# EAGLE design xclock_A (EAGLE 7.7.0)
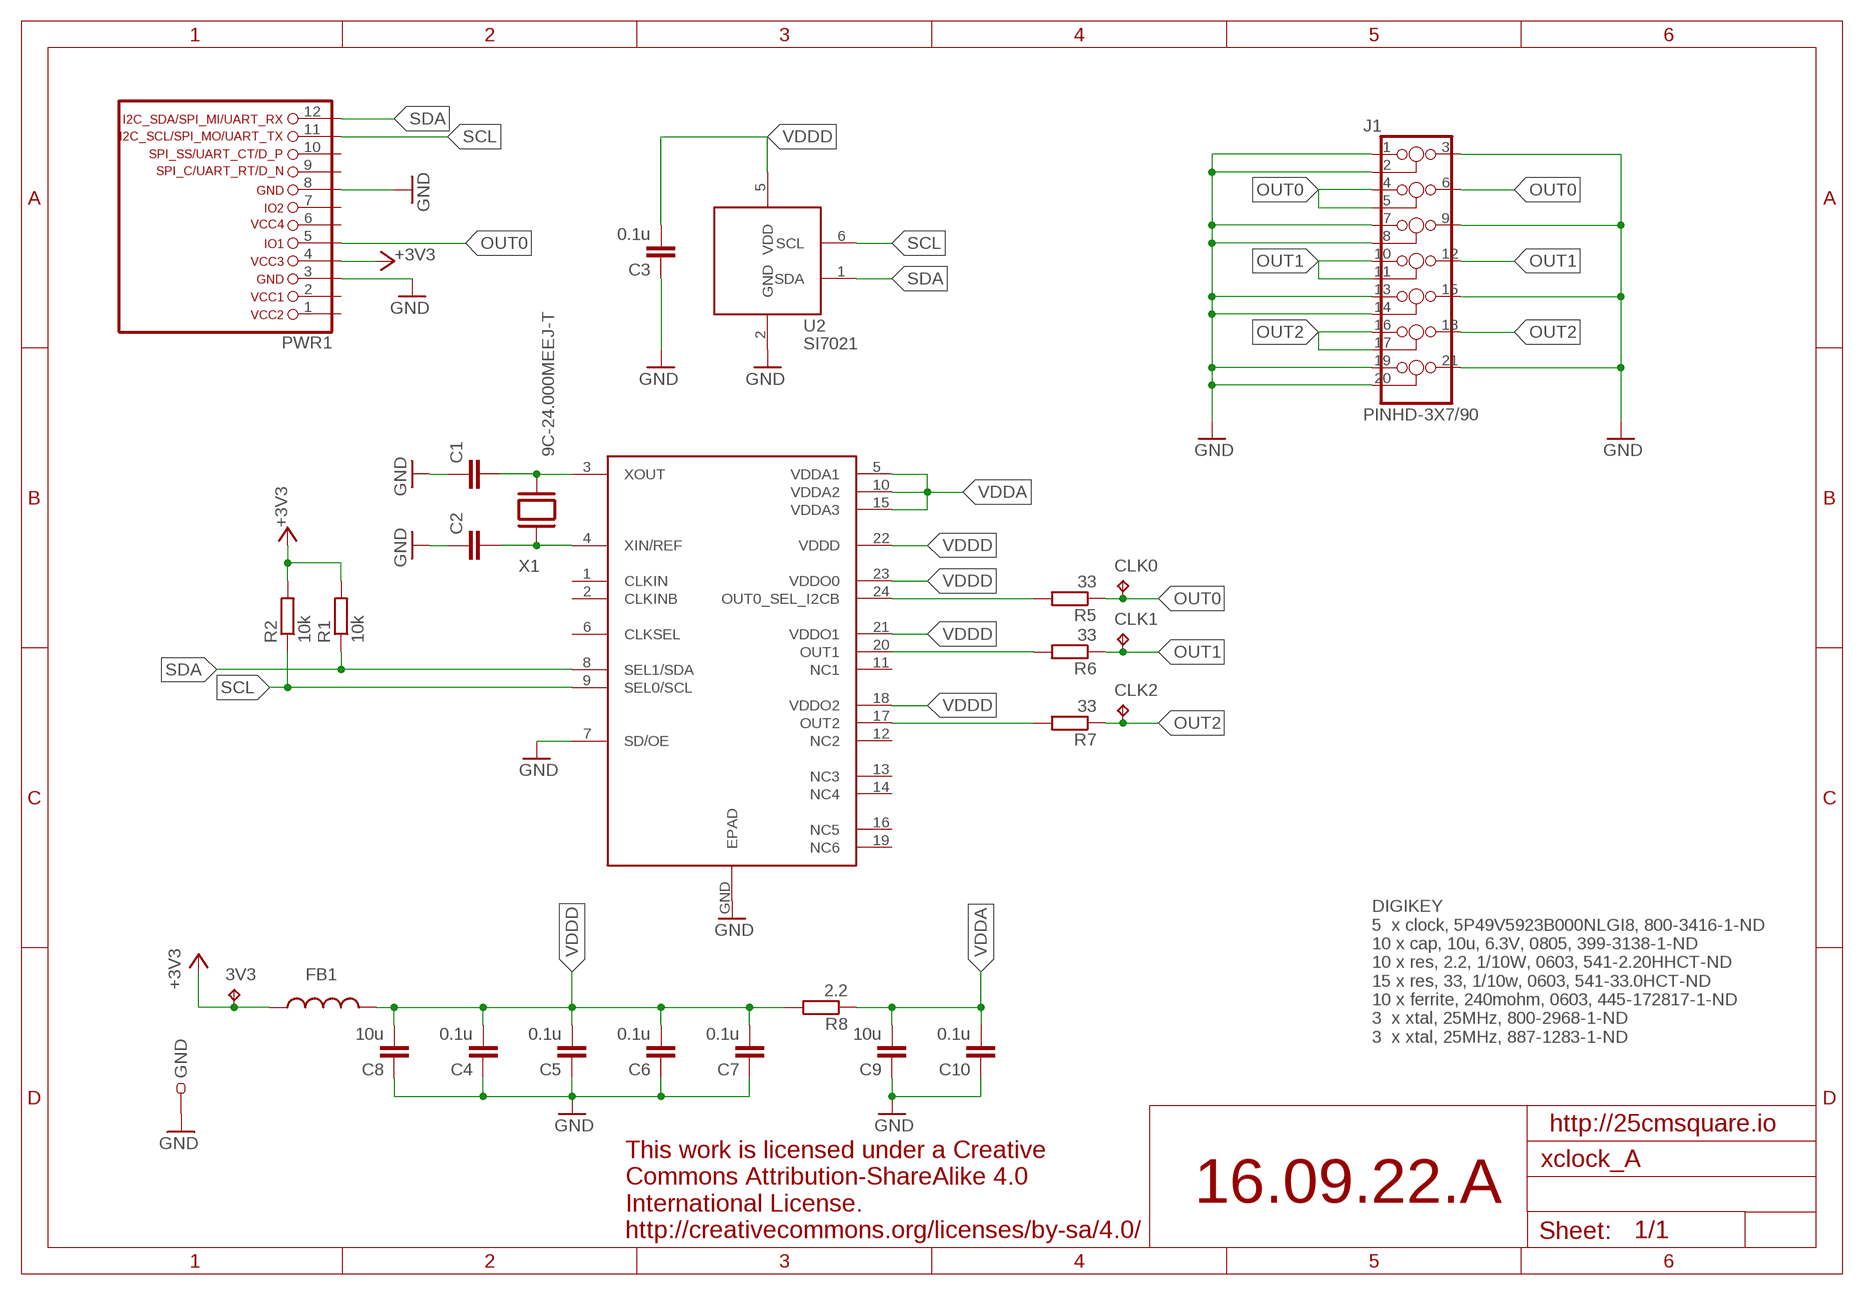
[diagram p0: schematic, sheet 1]

## Parts
3V3  TPB1,27  [B1,27]
C1  C-EUC0603  [C0603]
C2  C-EUC0603  [C0603]
C3  0.1u  C-EUC0603  [C0603]
C4  0.1u  C-EUC0603  [C0603]
C5  0.1u  C-EUC0603  [C0603]
C6  0.1u  C-EUC0603  [C0603]
C7  0.1u  C-EUC0603  [C0603]
C8  10u  C-EUC0805  [C0805]
C9  10u  C-EUC0805  [C0805]
C10  0.1u  C-EUC0603  [C0603]
CLK0  TPB1,27  [B1,27]
CLK1  TPB1,27  [B1,27]
CLK2  TPB1,27  [B1,27]
FB1  L0603(1608)  [L0603]
GND  TEST-22-MULTICOMP  [TEST_1MM]
J1  PINHD-3X7/90  [3X07/90]
PWR1  LIWE_12_PIN_PWR  [LIWE_12_PIN]
R1  10k  R-EU_R0603  [R0603]
R2  10k  R-EU_R0603  [R0603]
R5  33  R-EU_R0603  [R0603]
R6  33  R-EU_R0603  [R0603]
R7  33  R-EU_R0603  [R0603]
R8  2.2  R-EU_R0603  [R0603]
U1  5P49V5923  [VFQFPN_24_4X4]
U2  SI7021  [SI7021]
X1  9C-24.000MEEJ-T  TXC_9C  [TXC_SMD_HC-49S]

## Nets
+3V3: 3V3.TP FB1.1 PWR1.4 R1.2 R2.2
GND: C1.1 C2.1 C3.1 C4.1 C5.1 C6.1 C7.1 C8.1 C9.1 C10.1 GND.1 J1.1 J1.2 J1.3 J1.7 J1.8 J1.9 J1.13 J1.14 J1.15 J1.19 J1.20 J1.21 PWR1.3 PWR1.8 U1.7(SD/OE) U1.GND(EPAD) U2.2(GND)
N$6: R5.2 U1.24(OUT0_SEL_I2CB)
N$8: R6.2 U1.20(OUT1)
N$9: R7.2 U1.17(OUT2)
OUT0: CLK0.TP J1.4 J1.5 J1.6 PWR1.5 R5.1
OUT1: CLK1.TP J1.10 J1.11 J1.12 R6.1
OUT2: CLK2.TP J1.16 J1.17 J1.18 R7.1
SCL: PWR1.11 R2.1 U1.9(SEL0/SCL) U2.6(SCL)
SDA: PWR1.12 R1.1 U1.8(SEL1/SDA) U2.1(SDA)
VDDA: C9.2 C10.2 R8.1 U1.5(VDDA1) U1.10(VDDA2) U1.15(VDDA3)
VDDD: C3.2 C4.2 C5.2 C6.2 C7.2 C8.2 FB1.2 R8.2 U1.18(VDDO2) U1.21(VDDO1) U1.22(VDDD) U1.23(VDDO0) U2.5(VDD)
XIN: C2.2 U1.4(XIN/REF) X1.1
XOUT: C1.2 U1.3(XOUT) X1.2
Unconnected: PWR1.1 PWR1.2 PWR1.6 PWR1.7 PWR1.9 PWR1.10 U1.1(CLKIN) U1.2(CLKINB) U1.6(CLKSEL) U1.11(NC1) U1.12(NC2) U1.13(NC3) U1.14(NC4) U1.16(NC5) U1.19(NC6)

## Notes on the sheet
- DIGIKEY
  5  x clock, 5P49V5923B000NLGI8, 800-3416-1-ND
  10 x cap, 10u, 6.3V, 0805, 399-3138-1-ND
  10 x res, 2.2, 1/10W, 0603, 541-2.20HHCT-ND
  15 x res, 33, 1/10w, 0603, 541-33.0HCT-ND
  10 x ferrite, 240mohm, 0603, 445-172817-1-ND
  3  x xtal, 25MHz, 800-2968-1-ND
  3  x xtal, 25MHz, 887-1283-1-ND
- http://25cmsquare.io
- 16.09.22.A
- This work is licensed under a Creative
  Commons Attribution-ShareAlike 4.0
  International License.
  http://creativecommons.org/licenses/by-sa/4.0/

## Library data of the parts
3V3 CLK0 CLK1 CLK2 = testpad:TP: Test pad
C1-C10 = rcl:C-EU: CAPACITOR, European symbol
FB1 = 25cmsquare:L
GND = 25cmsquare:TEST-22-MULTICOMP: MULTICOMP TEST-22 TEST PIN, PCB, 1.0MM FARNELL: 1702010
J1 = 25pinhead:PINHD-3X7
PWR1 = 25cmsquare:LIWE_12_PIN_PWR
R1 R2 R5-R8 = rcl:R-EU_: RESISTOR, European symbol
U1 = 25cmsquare:5P49V5923
U2 = 25cmsquare:SI7021: SI7021 https://www.silabs.com/Support%20Documents/TechnicalDocs/Si7021-A20.pdf
X1 = 25cmsquare:TXC_9C

## Board
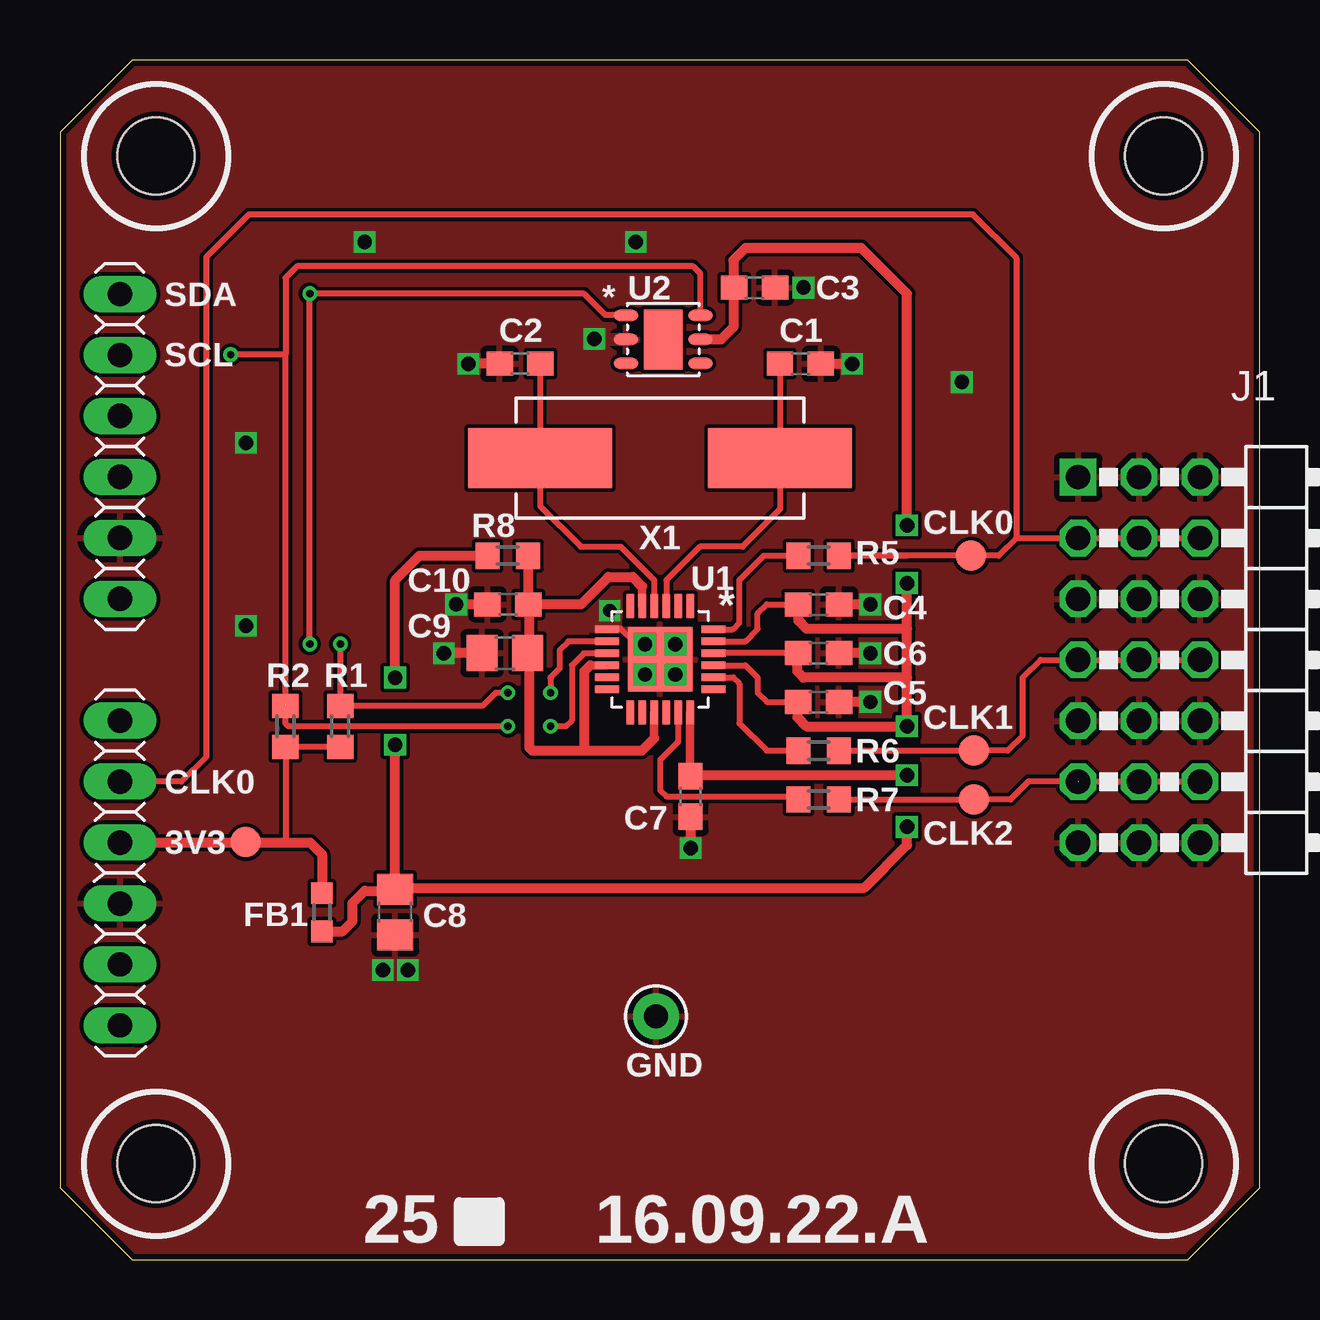
[diagram p1: board, top side]
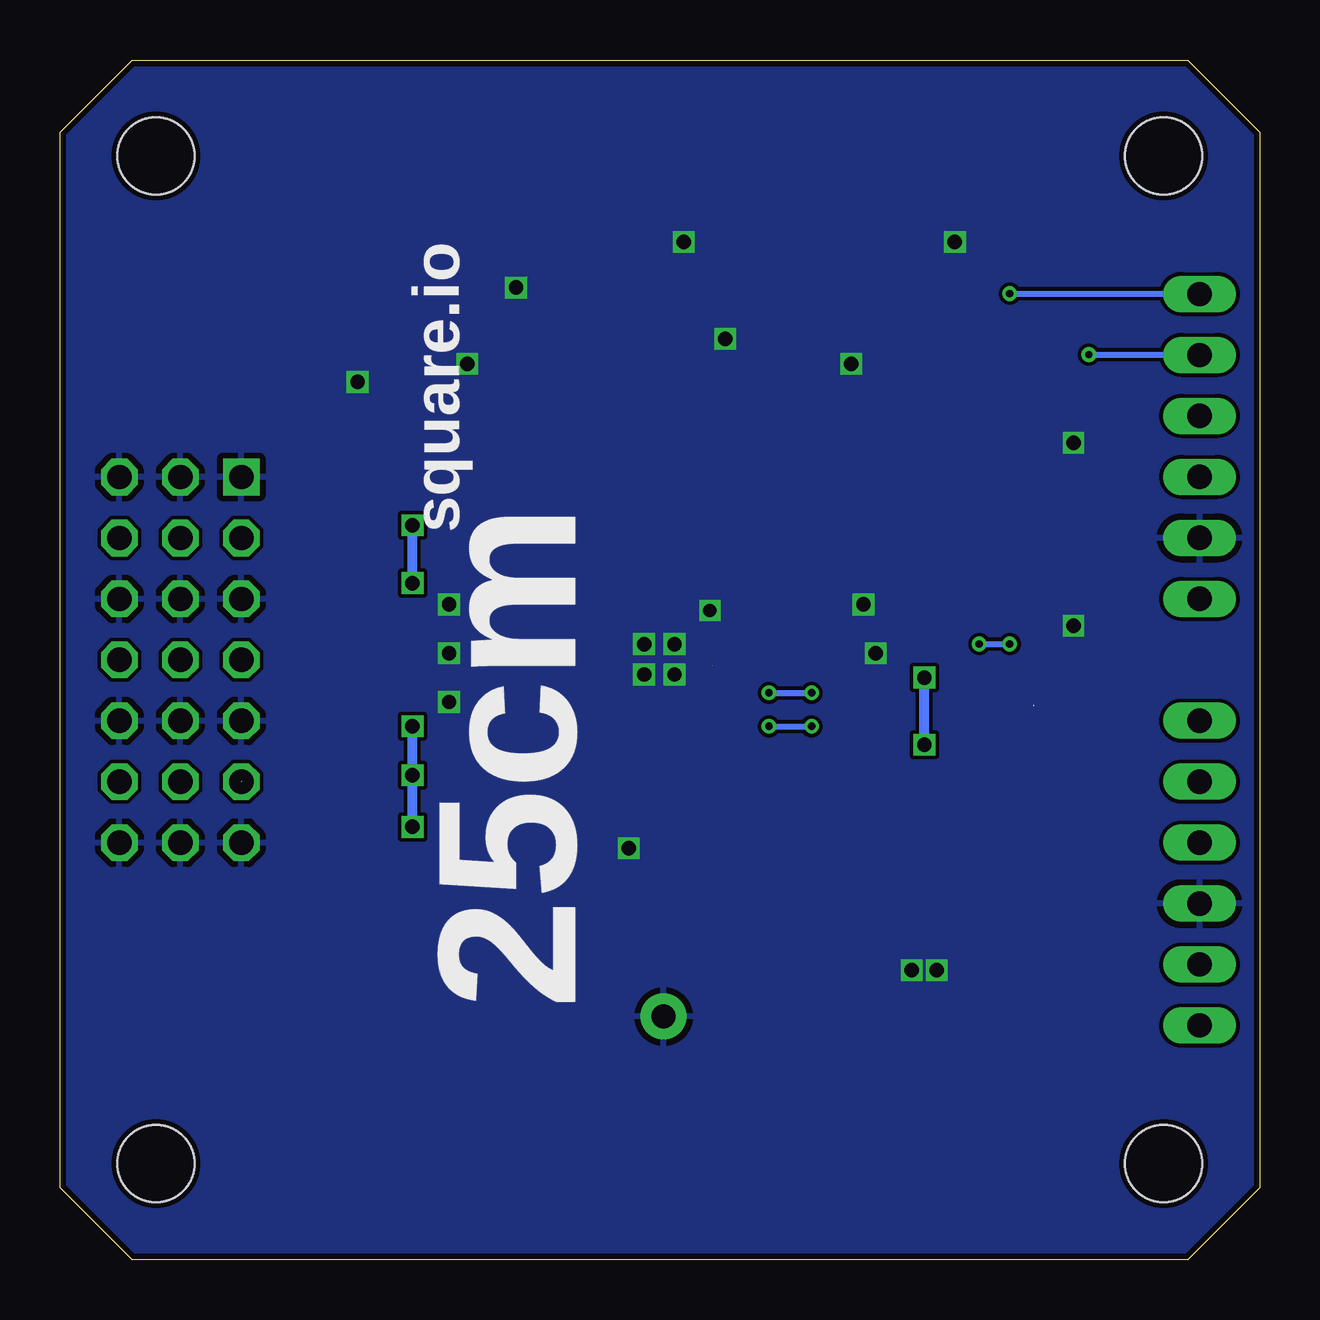
[diagram p2: board, bottom side, seen from below]

Size 50 x 50 mm. Coordinates in mm from the lower left corner, seen from the top.
Copper layers (1*16): Top 0.035mm / dielectric 1.5mm / Bottom 0.035mm
Design rules "SeeedStudio_2layer_DRU_no_angle_20140221": minimum track width 6mil, minimum drill 12mil, track to track 6mil, track to pad 6mil, pad to pad 6mil, via to via 6mil, smd to smd 0mil, copper to edge 10mil, drill to drill 10mil, minimum pad ring 10mil, minimum via ring 6mil, stop-mask expansion 2mil, vias tented up to drill 100mil, thermal gap 10mil

### Footprints (pad centres in the part's own frame; a part is rotated, then mirrored left to right if it is on the bottom)
B1,27 = smd 1.27 x 1.27: TP 0,0
C0603 = smd 1.1 x 1: 1 -0.85,0; 2 0.85,0
C0805 = smd 1.3 x 1.5: 1 -0.95,0; 2 0.95,0
L0603 = smd 0.9 x 0.9: 1 -0.8,0; 2 0.8,0
TEST_1MM = drill 1 pad 1.93: 1 0,0
3X07/90 = drill 1.016 square: 1 -7.62,-8.89 | drill 1.016 octagon: 2 -7.62,-6.35; 3 -7.62,-3.81; 4 -5.08,-8.89; 5 -5.08,-6.35; 6 -5.08,-3.81; 7 -2.54,-8.89; 8 -2.54,-6.35; 9 -2.54,-3.81; 10 0,-8.89; 11 0,-6.35; 12 0,-3.81; 13 2.54,-8.89; 14 2.54,-6.35; 15 2.54,-3.81; 16 5.08,-8.89; 17 5.08,-6.35; 18 5.08,-3.81; 19 7.62,-8.89; 20 7.62,-6.35; 21 7.62,-3.81
LIWE_12_PIN = drill 1.016 long: 1 22.5,15.24; 2 22.5,12.7; 3 22.5,10.16; 4 22.5,7.62; 5 22.5,5.08; 6 22.5,2.54; 7 22.5,-2.54; 8 22.5,-5.08; 9 22.5,-7.62; 10 22.5,-10.16; 11 22.5,-12.7; 12 22.5,-15.24 | hole 3.2: -21,-21; 21,-21; -21,21; 21,21
R0603 = smd 1 x 1.1: 1 -0.85,0; 2 0.85,0
VFQFPN_24_4X4 = smd 0.32 x 1: 1 -1.25,-2.215; 2 -0.75,-2.215; 3 -0.25,-2.215; 4 0.25,-2.215; 5 0.75,-2.215; 6 1.25,-2.215; 13 1.25,2.215; 14 0.75,2.215; 15 0.25,2.215; 16 -0.25,2.215; 17 -0.75,2.215; 18 -1.25,2.215 | smd 1 x 0.32: 7 2.215,-1.25; 8 2.215,-0.75; 9 2.215,-0.25; 10 2.215,0.25; 11 2.215,0.75; 12 2.215,1.25; 19 -2.215,1.25; 20 -2.215,0.75; 21 -2.215,0.25; 22 -2.215,-0.25; 23 -2.215,-0.75; 24 -2.215,-1.25 | smd 2.7 x 2.7: GND 0,0
SI7021 = smd 1 x 0.45: 1 -1.55,1; 2 -1.55,0; 3 -1.55,-1; 4 1.55,-1; 5 1.55,0; 6 1.55,1 | smd 1.6 x 2.5: P$7 0,0
TXC_SMD_HC-49S = smd 6 x 2.5: 1 -5,0; 2 5,0

### Placement (x,y rotation side)
3V3  7.75,17.4 0 top
C1  30.86,37.34 180 top
C2  19.18,37.34 0 top
C3  28.96,40.51 180 top
C4  31.62,27.3 180 top
C5  31.62,23.24 180 top
C6  31.62,25.27 180 top
C7  26.29,19.3 90 top
C8  13.97,14.48 90 top
C9  18.54,25.27 0 top
C10  18.67,27.3 0 top
CLK0  37.97,29.34 0 top
CLK1  38.1,21.21 0 top
CLK2  38.1,19.18 0 top
FB1  10.92,14.48 270 top
GND  24.84,10.13 0 top
J1  51.33,24.99 270 top
PWR1  25,25 180 top
R1  11.68,22.23 270 top
R2  9.4,22.23 270 top
R5  31.62,29.34 180 top
R6  31.62,21.21 180 top
R7  31.62,19.18 180 top
R8  18.67,29.34 180 top
U1  25.02,25.02 180 top
U2  25.15,38.35 0 top
X1  25.02,33.4 0 top

### Tracks (layer width: path | path; a pad name or v marks a point on that pad's centre or on a via)
+3V3
  Top 0.254: 3V3.TP 7.77,17.38 9.4,17.38 R2.2 R1.2
  Top 0.406: PWR1.4 9.4,17.38 10.43,17.38 10.92,16.89 FB1.1
GND  (via drill 0.56, 0.6)
  Top 0.254: U1.7 arc-90 22.82,26.29 23.37,26.29 23.88,25.78 24.2,25.57 | 24.2,25.57 U1.GND | v24.38,25.65 24.29,25.65 24.2,25.57
  Top 0.406: C10.1 v16.51,27.3 | C9.1 v16,25.27 | v33.78,27.3 C4.1 | v33.78,25.27 C6.1 | v33.78,23.24 C5.1 | C7.1 v26.29,17.14 | C2.1 v17.02,37.34 | C1.1 v33.02,37.34
  other vias: 25.65,25.65 25.65,24.38 24.38,24.38 30.99,40.51 24,42.42 12.7,42.42 7.75,34.04 7.75,26.42 37.59,36.58 14.5,12.06 13.46,12.06 22.91,27.05 22.28,38.38
  pour Bottom: -2.03,52.07 -2.03,-2.54 52.45,-2.54 52.45,52.07
  pour Top: -3.68,54.23 -3.68,-4.95 55.63,-4.95 55.63,54.23
  pour Top (no thermals): 23.75,38.48 22.73,38.48 22.73,38.23 23.75,38.23
  pour Top (no thermals): 21.92,26.72 21.92,26.34 23.32,26.34 23.32,26.72
N$6
  Top 0.254: U1.24 28.05,26.27 28.32,26.54 28.32,28.32 29.34,29.34 R5.2
N$8
  Top 0.254: U1.20 28.05,24.27 28.32,24 28.32,22.35 29.46,21.21 R6.2
N$9
  Top 0.254: U1.17 25.77,21.58 25.02,20.83 25.02,19.56 25.27,19.3 30.65,19.3 R7.2
OUT0
  Top 0.254: 39.86,30.08 39.12,29.34 CLK0.TP R5.1 35.31,29.34 | 2.48,19.94 PWR1.5 5.06,19.92 6.1,20.95 6.1,41.78 7.87,43.56 38.06,43.56 39.86,41.76 39.86,30.08 | 39.86,30.08 44.42,30.08 | 44.42,30.08 46.94,30.08 | 46.94,30.08 J1.6 | J1.4 44.42,30.07 44.42,30.08 | J1.5 46.94,30.07 46.94,30.08
OUT1
  Top 0.254: R6.1 CLK1.TP 39.51,21.21 40.13,21.83 40.13,24.26 40.88,25 J1.10 J1.11 J1.12
OUT2  (1 unrouted)
  Top 0.254: R7.1 CLK2.TP 39.62,19.18 40.39,19.94 42.43,19.94 | J1.18 J1.17 J1.16
SCL  (via drill 0.3)  (1 unrouted)
  Top 0.254: U1.9 21.84,25.27 21.34,24.77 21.34,22.48 21.08,22.23 v20.45,22.23 | v18.67,22.23 9.53,22.23 9.4,22.35 R2.1 | 9.4,23.11 9.4,37.72 | U2.6 26.7,41.09 26.39,41.4 9.88,41.4 9.4,40.92 9.4,37.72 | 9.4,37.72 v7.11,37.72 | 2.52,37.72 PWR1.11 arc-90 2.52,37.72
  Bottom 0.254: v20.45,22.23 v18.67,22.23 | v7.11,37.72 2.52,37.72 PWR1.11
SDA  (via drill 0.3)
  Top 0.254: U1.8 21.2,25.77 20.83,25.4 20.83,24.64 20.45,24.26 v20.45,23.62 | v10.41,25.65 v10.41,40.26 21.84,40.26 22.73,39.37 23.68,39.37 U2.1 | v18.67,23.62 18.16,23.62 17.61,23.07 R1.1 v11.68,25.65
  Bottom 0.254: v20.45,23.62 v18.67,23.62 | v11.68,25.65 v10.41,25.65 | v10.41,40.26 2.52,40.26 PWR1.12
VDDA  (1 unrouted)
  Top 0.254: C10.2 19.52,25.3 C9.2
  Top 0.356: 24.27,28.05 U1.5 | 24.77,21.72 U1.15 | U1.10 22.1,24.77
  Top 0.406: R8.1 C10.2 19.56,27.3 | 24.27,28.05 23.88,28.45 22.86,28.45 21.72,27.3 19.56,27.3 | 19.56,27.3 19.56,21.34 19.68,21.21 21.84,21.21 | 21.84,21.21 24.26,21.21 24.77,21.72 | 22.1,24.77 21.84,24.51 21.84,21.21
VDDD  (via drill 0.6)
  Top 0.254: 30.73,27.3 C4.2 | C6.2 U1.22 | C5.2 30.73,23.24 29.46,23.24 29.08,23.62 29.08,24.26 28.57,24.77 U1.21 | U1.23 28.56,25.77 29.08,26.29 29.08,26.92 29.46,27.3 30.73,27.3 | 30.73,27.3 30.73,26.67 31.11,26.29 | 28.07,41.66 28.11,41.62 C3.2
  Top 0.356: U1.18 26.27,20.15
  Top 0.406: v35.31,18.03 35.31,17.27 33.53,15.49 14.04,15.49 C8.2 | 35.31,24.26 v35.31,22.23 31.11,22.23 30.73,22.61 30.73,23.24 | 35.31,26.29 31.11,26.29 30.77,26.63 C4.2 | 35.31,24.26 30.99,24.26 30.73,24.51 30.73,25.23 C6.2 | v35.31,20.19 26.45,20.19 C7.2 26.27,20.15 | C8.2 v13.97,21.46 | v13.97,24.26 13.97,28.32 14.99,29.34 R8.2 | FB1.2 11.77,13.68 12.19,14.1 12.19,14.86 12.7,15.37 13.91,15.37 C8.2 | 35.31,24.26 35.31,26.29 | 35.31,26.29 v35.31,28.19 | v35.31,30.61 35.31,40.26 33.4,42.16 28.57,42.16 28.07,41.66 28.07,38.86 27.56,38.35 U2.5
  Bottom 0.406: v35.31,18.03 v35.31,20.19 v35.31,22.23 | v13.97,21.46 v13.97,24.26 | v35.31,28.19 v35.31,30.61
XIN
  Top 0.254: X1.1 20.02,31.42 21.72,29.72 23.37,29.72 24.77,28.32 U1.4 | 20.07,33.45 X1.1 | C2.2 20.02,37.33 X1.1
XOUT
  Top 0.254: X1.2 30.02,31.29 28.45,29.72 26.67,29.72 25.27,28.32 U1.3 | 29.97,33.45 X1.2 | C1.2 X1.2

### Text on the board
tNames: SDA | SCL | CLK0 | 3V3 | 25 | 16.09.22.A
bNames: square.io | 25cm